# EAGLE design driver (EAGLE 8.3.1)
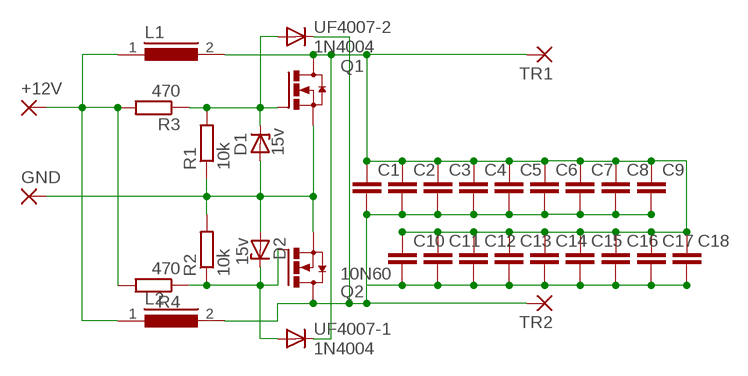
[diagram p0: schematic, sheet 1]

## Parts
+12V  3,17/1,1  [3,17/1,1]
C1  C-EU150-064X183  [C150-064X183]
C2  C-EU150-064X183  [C150-064X183]
C3  C-EU150-064X183  [C150-064X183]
C4  C-EU150-064X183  [C150-064X183]
C5  C-EU150-064X183  [C150-064X183]
C6  C-EU150-064X183  [C150-064X183]
C7  C-EU150-064X183  [C150-064X183]
C8  C-EU150-064X183  [C150-064X183]
C9  C-EU150-064X183  [C150-064X183]
C10  C-EU150-064X183  [C150-064X183]
C11  C-EU150-064X183  [C150-064X183]
C12  C-EU150-064X183  [C150-064X183]
C13  C-EU150-064X183  [C150-064X183]
C14  C-EU150-064X183  [C150-064X183]
C15  C-EU150-064X183  [C150-064X183]
C16  C-EU150-064X183  [C150-064X183]
C17  C-EU150-064X183  [C150-064X183]
C18  C-EU150-064X183  [C150-064X183]
D1  15v  ZENER-DIODEDO35Z10  [DO35Z10]
D2  15v  ZENER-DIODEDO35Z10  [DO35Z10]
GND  3,17/1,1  [3,17/1,1]
L1  R2408F11  [11-24]
L2  R2408F11  [11-24]
Q1  IRFP250  [TO-247AD-V]
Q2  10N60  IRFP250  [TO-247AD-V]
R1  10k  R-EU_0204/7  [0204/7]
R2  10k  R-EU_0204/7  [0204/7]
R3  470  R-EU_0617/17  [0617/17]
R4  470  R-EU_0617/17  [0617/17]
TR1  3,17/1,1  [3,17/1,1]
TR2  3,17/1,1  [3,17/1,1]
UF4007-1  1N4004  [DO41-10]
UF4007-2  1N4004  [DO41-10]

## Nets
N$1: D1.A D2.A GND.1(P) Q1.S Q2.S R1.1 R2.2
N$2: D1.C Q1.G R1.2 R3.1 UF4007-2.A
N$3: +12V.1(P) L1.1 L2.1 R3.2 R4.2
N$4: D2.C Q2.G R2.1 R4.1 UF4007-1.A
N$8: C1.2 C2.2 C3.2 C4.2 C5.2 C6.2 C7.2 C8.2 C9.2 C10.2 C11.2 C12.2 C13.2 C14.2 C15.2 C16.2 C17.2 C18.2 L2.2 Q2.D TR2.1(P) UF4007-2.C
N$9: C1.1 C2.1 C3.1 C4.1 C5.1 C6.1 C7.1 C8.1 C9.1 C10.1 C11.1 C12.1 C13.1 C14.1 C15.1 C16.1 C17.1 C18.1 L1.2 Q1.D TR1.1(P) UF4007-1.C

## Library data of the parts
+12V GND TR1 TR2 = wirepad:3,17/1,1: THROUGH-HOLE PAD
C1-C18 = resistor:C-EU: CAPACITOR, European symbol
D1 D2 = diode:ZENER-DIODE: Z-Diode
L1 L2 = inductor-nkl:R2408F: Gegentakt-Entstördrossel differential mode choke; OC_FARNELL: unknown; OC_NEWARK: unknown
Q1 Q2 = transistor-power:IRFP25*: 33A/27A, 200V/150V, 0.085/0.012 Ohm, N-Channel Power MOSFET Source: Fairchild Semiconductor Corporation
R1-R4 = resistor:R-EU_: RESISTOR, European symbol
UF4007-1 UF4007-2 = adafruit:1N4004: DIODE General purpose 1N400x type rectifier (With bigger pads) http://www.ladyada.net/library/pcb/eaglelibrary.html

## Board
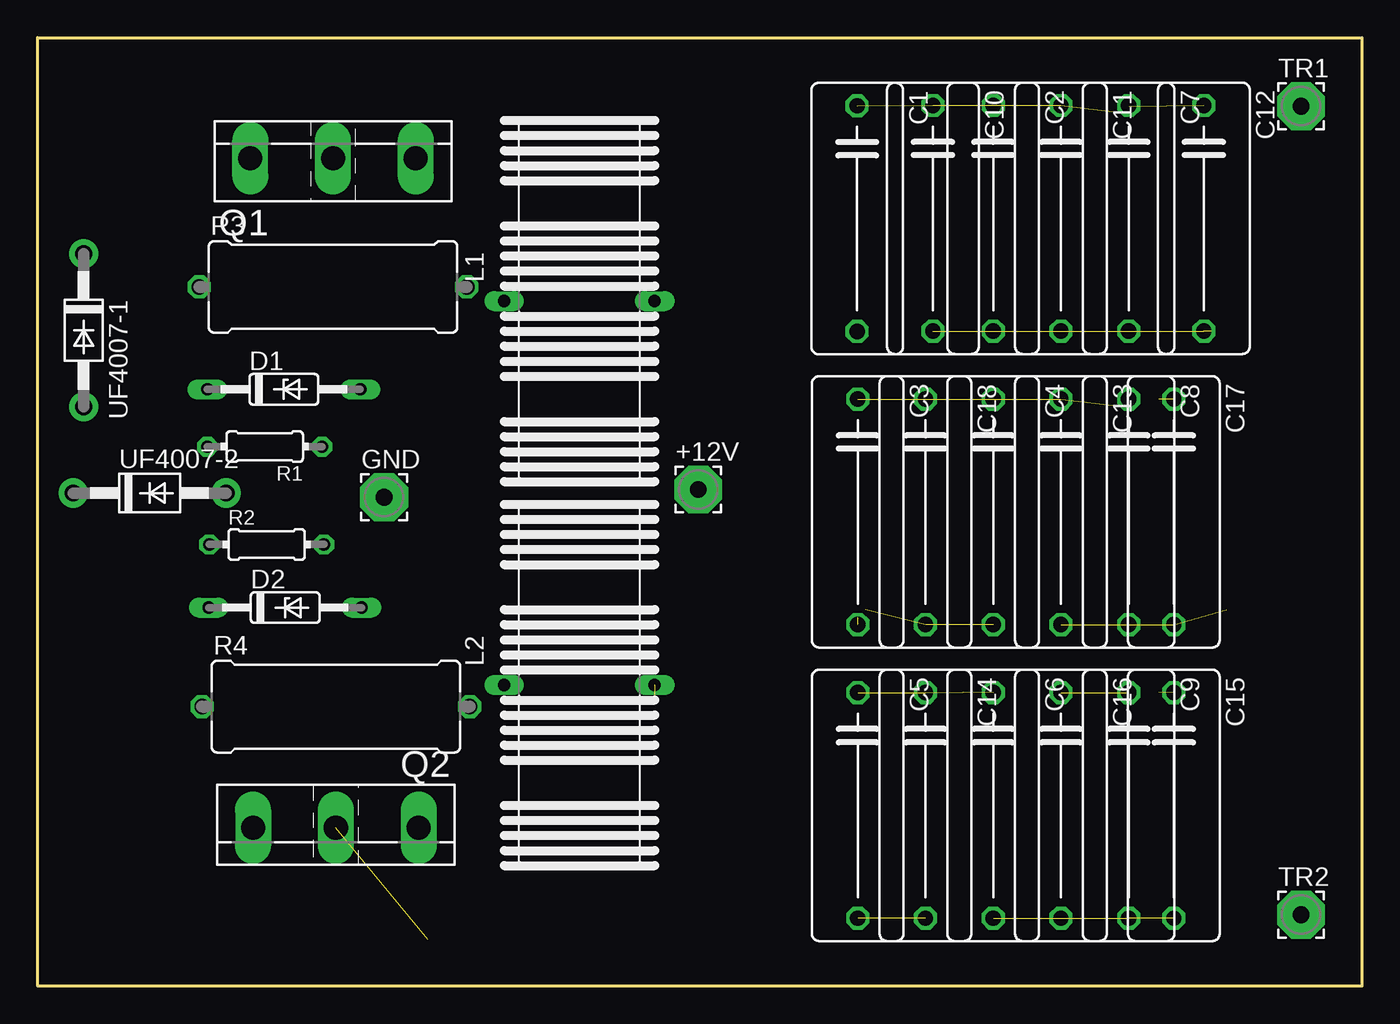
[diagram p1: board, top side]
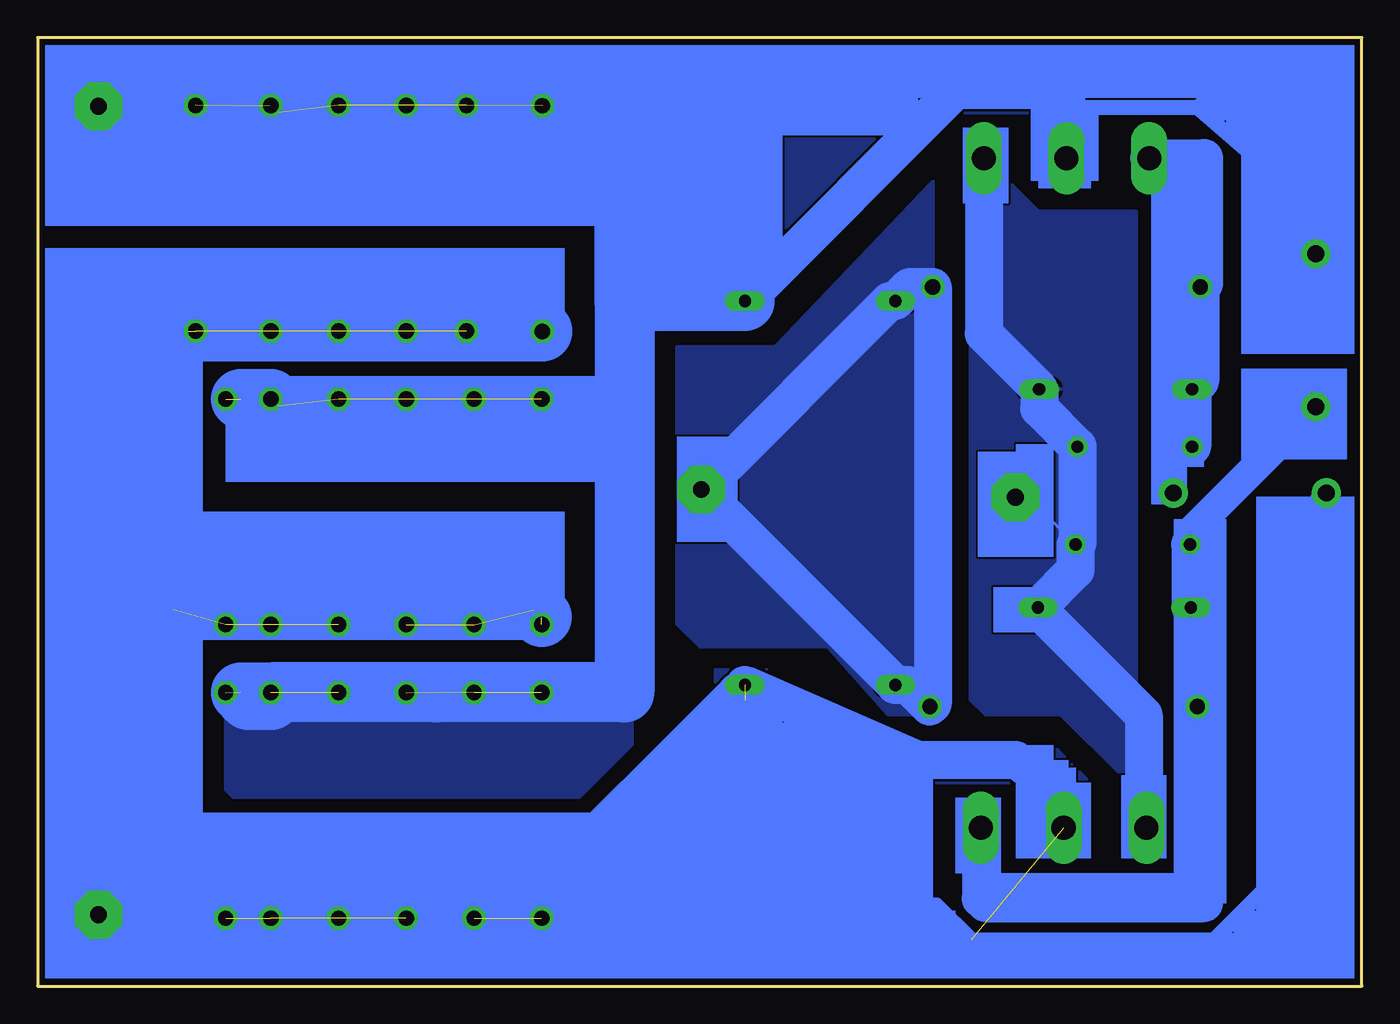
[diagram p2: board, bottom side, seen from below]

Size 88 x 63 mm. Coordinates in mm from the lower left corner, seen from the top.
Outline: 0,63 88,63 88,0 0,0 0,63
Copper layers (1*16): Top 0.035mm / dielectric 1.5mm / Bottom 0.035mm
Design rules "default *": minimum track width 1mm, minimum drill 0.35mm, track to track 6mil, track to pad 6mil, pad to pad 6mil, via to via 6mil, smd to smd 6mil, copper to edge 40mil, drill to drill 6mil, minimum pad ring 10mil, minimum via ring 8mil, stop-mask expansion 4mil, vias tented up to drill 0mil, thermal gap 10mil

### Footprints (pad centres in the part's own frame; a part is rotated, then mirrored left to right if it is on the bottom)
3,17/1,1 = drill 1.118 pad 3.175 octagon: 1 0,0
C150-064X183 = drill 1.016 octagon: 1 -7.493,0; 2 7.493,0
DO35Z10 = drill 0.813 long: A 5.08,0; C -5.08,0
11-24 = drill 0.813 long: 1 -5,0; 2 5,0
TO-247AD-V = drill 1.6 long: D 0,-2.54; G -5.5,-2.54; S 5.5,-2.54
0204/7 = drill 0.813 octagon: 1 -3.81,0; 2 3.81,0
0617/17 = drill 1.016 octagon: 1 -8.89,0; 2 8.89,0
DO41-10 = drill 1.118 pad 1.93: A 5.08,0; C -5.08,0

### Placement (x,y rotation side)
+12V  43.9,32.98 0 top
C1  54.46,50.98 270 top
C2  63.5,51 270 top
C3  54.5,31.5 270 top
C4  63.5,31.5 270 top
C5  54.5,12 270 top
C6  63.5,12 270 top
C7  72.5,51 270 top
C8  72.5,31.5 270 top
C9  72.5,12 270 top
C10  59.5,51 270 top
C11  68,51 270 top
C12  77.5,51 270 top
C13  68,31.5 270 top
C14  59,12 270 top
C15  75.5,12 270 top
C16  68,12 270 top
C17  75.5,31.5 270 top
C18  59,31.5 270 top
D1  16.36,39.64 0 top
D2  16.45,25.14 0 top
GND  23.02,32.47 0 top
L1  36,45.5 0 top
L2  36,20 0 top
Q1  19.63,57.53 0 top
Q2  19.82,7.97 180 top
R1  15.09,35.83 180 top
R2  15.22,29.33 0 top
R3  19.63,46.44 0 top
R4  19.82,18.56 0 top
TR1  83.96,58.45 0 top
TR2  83.96,4.74 0 top
UF4007-1  3.06,43.56 270 top
UF4007-2  7.44,32.75 0 top

### Tracks (layer width: path | path; a pad name or v marks a point on that pad's centre or on a via)
N$1
  Bottom 0.203: GND.1 22.17,32.47 R2.2
  Bottom 2.54: Q1.S 25.13,43.33 D1.A 21.44,38.37 R1.1 18.9,29.46 R2.2 19.03,27.64 D2.A 21.53,25.03 14.5,18 14.5,10.69 Q2.S
  pour Bottom: 25,55 21.5,51.5 15,51.5 15,14 16,14 20,18 25,18 26,19 26,54.5 26.5,55
N$2
  Bottom 1: UF4007-2.A 12.12,33.04 12.12,35.34 R1.2
  Bottom 2.54: Q1.G 10.51,54.99 10.5,55 10.5,46.68 R3.1 10.74,40.18 D1.C R1.2
N$3
  Bottom 2.54: 30.06,46.44 R3.2 28.52,18.75 R4.2 30.15,20 L2.1 43.9,32.9 +12V.1 31.38,45.5 L1.1 30.06,46.44
  pour Bottom: 28.5,18 31.5,18 35.5,22.5 44,22.5 45.5,24 45.5,42.5 39,42.5 28.5,53.5
N$4
  Bottom 1: UF4007-1.A 3.48,38.22 11.55,30.16 11.37,29.29
  Bottom 2: R2.1 11.41,30.13 UF4007-1.A
  Bottom 2.54: Q2.G 25.32,5.82 25,5.5 10.5,5.5 10.5,18.13 R4.1 10.93,24.7 D2.C 11.37,29.29 R2.1
N$6
  pour Bottom: 21.5,53.5 17.5,53.5 17.5,61 40.5,61 42.5,59 42.5,44 40.5,44 26.5,58 22,58 21.5,57.5
N$7
  pour Bottom: 23,8.5 18.5,8.5 18,9 18,13.5 20.5,16 31.5,16 33.5,18 36.5,18 39.5,21 43,21 43,7 41,5 28.5,5 28.5,13.5 23,13.5
N$8  (17 unrouted)
  Bottom 1: UF4007-2.C 2.91,32.46 2.91,9.99 9.82,3.08 25.95,3.08 28.26,5.38 28.5,5.38
  Bottom 2.54: L2.2 29.5,15 23,15 20.32,13.18 Q2.D
  Bottom 4: 79,4.51 C9.2 C5.2 54.5,5.5 41,19 | 79,4.51 83.73,4.51 TR2.1 | 79,4.51 79,25 | 79,25 79,42.5 78,43.5 54.47,43.5 C1.2 | 79,25 55,25 54.5,24.5
N$9  (15 unrouted)
  Bottom 1: 19.63,58.39 10.97,58.39 3.48,51.9 3.48,49.17 UF4007-1.C | 42.09,45.72 L1.2
  Bottom 2.54: Q1.D 19.63,58.39 19.63,59.13 20,59.5 27,59.5 L1.2
  Bottom 4: 72.5,19 74,19 74.5,19.5 C9.1 | L1.2 49,45.5 | 49,45.5 49,58 72.01,58 C7.1 72.54,58.45 TR1.1 | 49,45.5 49,38.5 | 49,38.5 49,19.5 61.5,19.5 C9.1 | 49,38.5 72.01,38.5 C8.1 74.49,38.99 74.5,39 | C9.1
  pour Bottom: 48.5,17.5 48.5,16.5 48.5,16 52,12.5 75,12.5 75.5,13 75.5,18 49,18
(copper drawn outside any net)
  shapes: Bottom area x46